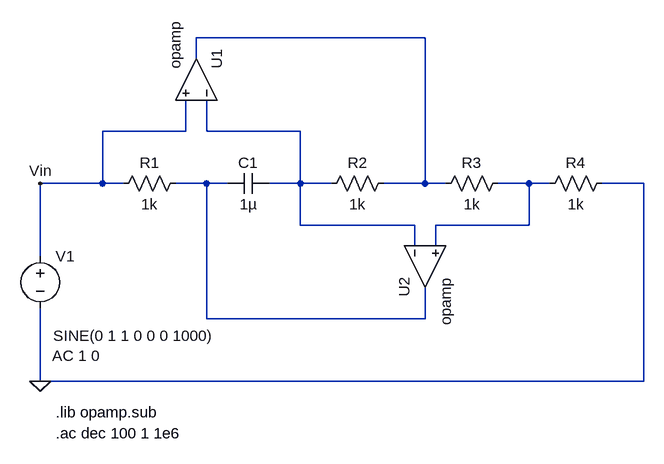
[diagram p0: schematic gic_c_to_l.asc]
gic_c_to_l.asc, the LTspice schematic file:
Version 4
SHEET 1 880 680
WIRE 448 -48 96 -48
WIRE 96 -16 96 -48
WIRE 80 96 80 48
WIRE 80 96 -48 96
WIRE 112 96 112 48
WIRE 256 96 112 96
WIRE -48 176 -48 96
WIRE -48 176 -144 176
WIRE -16 176 -48 176
WIRE 112 176 64 176
WIRE 144 176 112 176
WIRE 256 176 256 96
WIRE 256 176 208 176
WIRE 304 176 256 176
WIRE 448 176 448 -48
WIRE 448 176 384 176
WIRE 480 176 448 176
WIRE 608 176 560 176
WIRE 640 176 608 176
WIRE 784 176 720 176
WIRE 256 240 256 176
WIRE 432 240 256 240
WIRE 608 240 608 176
WIRE 608 240 464 240
WIRE 432 272 432 240
WIRE 464 272 464 240
WIRE -144 288 -144 176
WIRE 112 384 112 176
WIRE 448 384 448 336
WIRE 448 384 112 384
WIRE -144 480 -144 368
WIRE 784 480 784 176
WIRE 784 480 -144 480
FLAG -144 480 0
FLAG -144 176 Vin
SYMBOL res 80 160 R90
WINDOW 0 0 56 VBottom 2
WINDOW 3 32 56 VTop 2
SYMATTR InstName R1
SYMATTR Value 1k
SYMBOL res 400 160 R90
WINDOW 0 0 56 VBottom 2
WINDOW 3 32 56 VTop 2
SYMATTR InstName R2
SYMATTR Value 1k
SYMBOL res 576 160 R90
WINDOW 0 0 56 VBottom 2
WINDOW 3 32 56 VTop 2
SYMATTR InstName R3
SYMATTR Value 1k
SYMBOL res 736 160 R90
WINDOW 0 0 56 VBottom 2
WINDOW 3 32 56 VTop 2
SYMATTR InstName R4
SYMATTR Value 1k
SYMBOL cap 208 160 R90
WINDOW 0 0 32 VBottom 2
WINDOW 3 32 32 VTop 2
SYMATTR InstName C1
SYMATTR Value 1µ
SYMBOL Opamps\\opamp 160 16 M270
SYMATTR InstName U1
SYMATTR SpiceLine Aol=1000K
SYMATTR SpiceLine2 GBW=100Meg
SYMBOL Opamps\\opamp 384 304 M90
SYMATTR InstName U2
SYMATTR SpiceLine Aol=1000K
SYMATTR SpiceLine2 GBW=100Meg
SYMBOL voltage -144 272 R0
WINDOW 3 20 138 Left 2
WINDOW 123 18 169 Left 2
WINDOW 39 0 0 Left 0
SYMATTR InstName V1
SYMATTR Value SINE(0 1 1 0 0 0 1000)
SYMATTR Value2 AC 1 0
TEXT -120 528 Left 2 !.lib opamp.sub
TEXT -120 560 Left 2 !.ac dec 100 1 1e6

The netlist it stands for:
* gic_c_to_l.asc
R1 N003 Vin 1k
R2 N001 N002 1k
R3 N004 N001 1k
R4 0 N004 1k
C1 N002 N003 1µ
XU1 N002 Vin N001 opamp Aol=1000K GBW=100Meg  ; pins invin noninvin out
XU2 N002 N004 N003 opamp Aol=1000K GBW=100Meg  ; pins invin noninvin out
V1 Vin 0 SINE(0 1 1 0 0 0 1000) AC 1 0
.lib opamp.sub
.ac dec 100 1 1e6
.backanno
.end